# EAGLE schematic Led_Cup_Top_V3 (EAGLE 9.0.0)
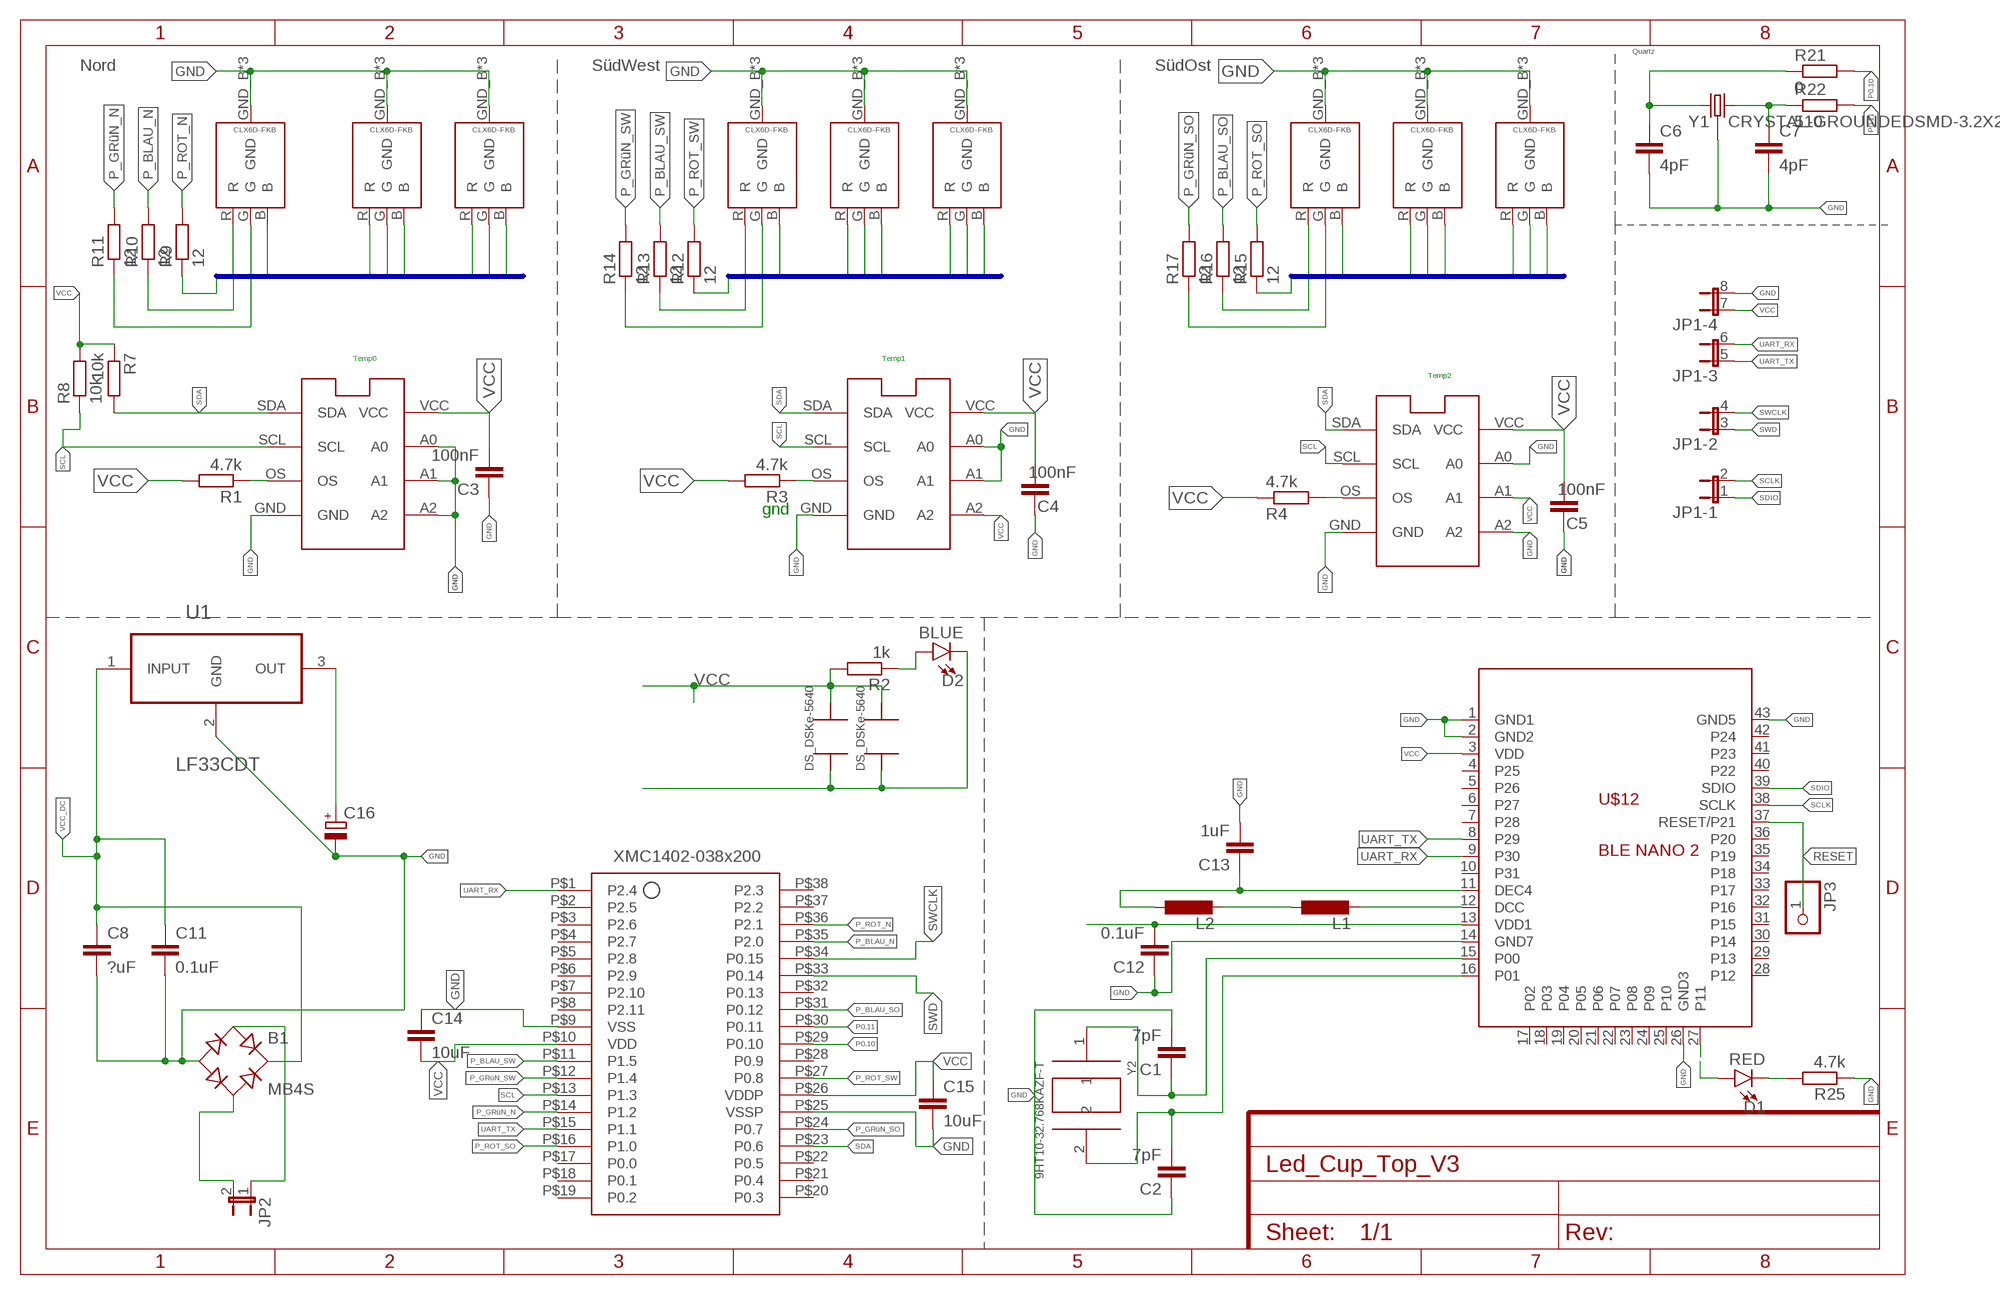
[diagram p0: schematic, sheet 1]

## Parts
B1  MB4S  [SOIC-4]
C1  7pF  C-EUC0805  [C0805]
C2  7pF  C-EUC0805  [C0805]
C3  100nF  C-EUC0805  [C0805]
C4  100nF  C-EUC0805  [C0805]
C5  100nF  C-EUC0805  [C0805]
C6  4pF  C-EUC0805  [C0805]
C7  4pF  C-EUC0805  [C0805]
C8  ?uF  C-EUC0805  [C0805]
C11  0.1uF  C-EUC0805  [C0805]
C12  0.1uF  C-EUC0805  [C0805]
C13  1uF  C-EUC0603  [C0603]
C14  10uF  C-EUC0805  [C0805]
C15  10uF  C-EUC0805  [C0805]
C16  CPOL-EUA/3216-18W  [A/3216-18W]
D1  RED  LED-RED0603  [LED-0603]
D2  BLUE  LED-BLUE0603  [LED-0603]
IC1  LM75Mini_TempS N  LM75MINI  [LM75MINI]
IC2  LM75Mini_TempSW  LM75MINI  [LM75MINI]
IC3  LM75Mini_TempSE  LM75MINI  [LM75MINI]
JP1  JP4QE  [JP4Q]
JP2  JP1E  [JP1]
JP3  PINHD-1X1  [1X01]
L1  L-EUL2012C  [L2012C]
L2  L-EUL2012C  [L2012C]
R1  4.7k  R-EU_R0805  [R0805]
R2  1k  R-EU_R0805  [R0805]
R3  4.7k  R-EU_R0805  [R0805]
R4  4.7k  R-EU_R0805  [R0805]
R7  10k  R-EU_R0805  [R0805]
R8  10k  R-EU_R0805  [R0805]
R9  12  R-EU_R0805  [R0805]
R10  12  R-EU_R0805  [R0805]
R11  12  R-EU_R0805  [R0805]
R12  12  R-EU_R0805  [R0805]
R13  12  R-EU_R0805  [R0805]
R14  12  R-EU_R0805  [R0805]
R15  12  R-EU_R0805  [R0805]
R16  12  R-EU_R0805  [R0805]
R17  12  R-EU_R0805  [R0805]
R21  0  R-EU_R0805  [R0805]
R22  510  R-EU_R0805  [R0805]
R25  4.7k  R-EU_R0805  [R0805]
U1  LF33CDT  [TO228P972X240-3N]
U$1  CREEPLCC6  [CREEPLCC6]
U$2  CREEPLCC6  [CREEPLCC6]
U$3  CREEPLCC6  [CREEPLCC6]
U$4  CREEPLCC6  [CREEPLCC6]
U$5  CREEPLCC6  [CREEPLCC6]
U$6  CREEPLCC6  [CREEPLCC6]
U$7  CREEPLCC6  [CREEPLCC6]
U$8  CREEPLCC6  [CREEPLCC6]
U$9  CREEPLCC6  [CREEPLCC6]
U$10  XMC1400_38P  [XMC1400_38P]
U$11  GOLDCAP  [GOLDCAP]
U$12  BLE NANO 2  RBT07  [RBT07]
U$13  GOLDCAP  [GOLDCAP]
Y1  CRYSTAL-GROUNDEDSMD-3.2X2.5  [CRYSTAL-SMD-3.2X2.5MM]
Y2  9HT10-32.768KAZF-T  [XTAL320X150X75]

## Nets
BLAU_N: R10.1 U$1.B U$2.B U$3.B
BLAU_SO: R16.1 U$7.B U$8.B U$9.B
BLAU_SW: R13.1 U$4.B U$5.B U$6.B
GND: B1.- C1.2 C2.1 C3.1 C4.1 C5.1 C6.2 C7.2 C8.2 C11.2 C12.1 C13.2 C14.1 C15.2 C16.- D2.C IC1.A0 IC1.A1 IC1.A2 IC1.GND IC2.A0 IC2.A1 IC2.GND IC3.A0 IC3.A2 IC3.GND JP1.8 R25.1 U1.2(GND) U$1.GND_B(GND) U$1.GND_G(GND) U$1.GND_R(GND) U$2.GND_B(GND) U$2.GND_G(GND) U$2.GND_R(GND) U$3.GND_B(GND) U$3.GND_G(GND) U$3.GND_R(GND) U$4.GND_B(GND) U$4.GND_G(GND) U$4.GND_R(GND) U$5.GND_B(GND) U$5.GND_G(GND) U$5.GND_R(GND) U$6.GND_B(GND) U$6.GND_G(GND) U$6.GND_R(GND) U$7.GND_B(GND) U$7.GND_G(GND) U$7.GND_R(GND) U$8.GND_B(GND) U$8.GND_G(GND) U$8.GND_R(GND) U$9.GND_B(GND) U$9.GND_G(GND) U$9.GND_R(GND) U$10.P$9(VSS) U$10.P$25(VSSP) U$11.P$1 U$12.1(GND1) U$12.2(GND2) U$12.14(GND7) U$12.26(GND3) U$12.43(GND5) U$13.P$1 Y1.2 Y1.4
GRüN_N: R11.1 U$1.G U$2.G U$3.G
GRüN_SO: R17.1 U$7.G U$8.G U$9.G
GRüN_SW: R14.1 U$4.G U$5.G U$6.G
N$1: IC1.OS R1.1
N$2: IC3.OS R4.2
N$3: IC2.OS R3.1
N$7: C16.+ U1.3(OUT)
N$28: B1.~2(AC2) JP2.2
N$29: C7.1 R22.1 Y1.3
N$30: C6.1 R21.1 Y1.1
N$34: D2.A R2.1
N$35: B1.~1(AC1) JP2.1
N$36: L1.2 U$12.12(DCC)
N$38: L1.1 L2.2
N$39: C13.1 L2.1 U$12.11(DEC4)
N$70: C1.1 U$12.15(P00) Y2.1
N$71: C2.2 U$12.16(P01) Y2.2
N$74: D1.C R25.2
N$75: D1.A U$12.27(P11)
P0.10: R21.2 U$10.P$29(P0.10)
P0.11: R22.2 U$10.P$30(P0.11)
P_BLAU_N: R10.2 U$10.P$35(P2.0)
P_BLAU_SO: R16.2 U$10.P$31(P0.12)
P_BLAU_SW: R13.2 U$10.P$11(P1.5)
P_GRüN_N: R11.2 U$10.P$14(P1.2)
P_GRüN_SO: R17.2 U$10.P$24(P0.7)
P_GRüN_SW: R14.2 U$10.P$12(P1.4)
P_ROT_N: R9.2 U$10.P$36(P2.1)
P_ROT_SO: R15.2 U$10.P$16(P1.0)
P_ROT_SW: R12.2 U$10.P$27(P0.8)
RESET: JP3.1 U$12.37(RESET/P21)
ROT_N: R9.1 U$1.R U$2.R U$3.R
ROT_SO: R15.1 U$7.R U$8.R U$9.R
ROT_SW: R12.1 U$4.R U$5.R U$6.R
SCL: IC1.SCL IC2.SCL IC3.SCL R8.1 U$10.P$13(P1.3)
SCLK: JP1.2 U$12.38(SCLK)
SDA: IC1.SDA IC2.SDA IC3.SDA R7.2 U$10.P$23(P0.6)
SDIO: JP1.1 U$12.39(SDIO)
SWCLK: JP1.4 U$10.P$34(P0.15)
SWD: JP1.3 U$10.P$33(P0.14)
UART_RX: JP1.6 U$10.P$1(P2.4) U$12.9(P30)
UART_TX: JP1.5 U$10.P$15(P1.1) U$12.8(P29)
VCC: C3.2 C4.2 C5.2 C12.2 C14.2 C15.1 IC1.VCC IC2.A2 IC2.VCC IC3.A1 IC3.VCC JP1.7 R1.2 R2.2 R3.2 R4.1 R7.1 R8.2 U$10.P$10(VDD) U$10.P$26(VDDP) U$11.P$2 U$12.3(VDD) U$12.13(VDD1) U$13.P$2
VCC_DC: B1.+ C8.1 C11.1 U1.1(INPUT)
Unconnected: U$10.P$2(P2.5) U$10.P$3(P2.6) U$10.P$4(P2.7) U$10.P$5(P2.8) U$10.P$6(P2.9) U$10.P$7(P2.10) U$10.P$8(P2.11) U$10.P$17(P0.0) U$10.P$18(P0.1) U$10.P$19(P0.2) U$10.P$20(P0.3) U$10.P$21(P0.4) U$10.P$22(P0.5) U$10.P$28(P0.9) U$10.P$32(P0.13) U$10.P$37(P2.2) U$10.P$38(P2.3) U$12.4(P25) U$12.5(P26) U$12.6(P27) U$12.7(P28) U$12.10(P31) U$12.17(P02) U$12.18(P03) U$12.19(P04) U$12.20(P05) U$12.21(P06) U$12.22(P07) U$12.23(P08) U$12.24(P09) U$12.25(P10) U$12.28(P12) U$12.29(P13) U$12.30(P14) U$12.31(P15) U$12.32(P16) U$12.33(P17) U$12.34(P18) U$12.35(P19) U$12.36(P20) U$12.40(P22) U$12.41(P23) U$12.42(P24)

## Buses
ROT_N,BLAU_N,GRüN_N,WHITE_N
ROT_SW,BLAU_SW,GRüN_SW,WHITE_SW
ROT_SO,BLAU_SO,GRüN_SO,WHITE_SO

## Notes on the sheet
- Quartz
- Nord | SüdWest | SüdOst
- Temp0 | Temp1
- Temp2
- gnd

## Library data of the parts
B1 = rectifier:MB*S: Bridge Rectifier Source: http://www.fairchildsemi.com/ds/MB/MB6S.pdf
C1-C8 C11-C15 = rcl:C-EU: CAPACITOR, European symbol; SPICEPREFIX: C
C16 = rcl:CPOL-EU: POLARIZED CAPACITOR, European symbol; SPICEPREFIX: C
D1 = SparkFun-LED:LED-RED: Red SMD LED Used in manufacturing of most products at SparkFun Packages: 0603 - SMD 0603 package [Product Link] <http://docs.avagotech.com/docs/AV02-0551EN> 0603 SMART - SMD 0603 SMART package ( more efficient and expensive)[Product Link] <http://www.osram-os.com/Graphics/XPic2/00077099_0.pdf> 1206 - SMD1206 package [Product Link] <https://www.sparkfun.com/datasheets/DevTools/LilyPad/Q150OVS4.pdff> SparkFun Products: Pro Mini 328 -5V <https://www.sparkfun.com/products/821> RedBoard <https://www.sparkfun.com/products/12757> IOIO-OTG <https://www.sparkfun.com/products/13613>; PROD_ID: DIO-00819
D2 = SparkFun-LED:LED-BLUE: Blue SMD LED Used in manufacturing of various products at SparkFun Packages: 0603 - SMD 0603 package [Product Link] <http://www.digikey.com/product-detail/en/SMLE12BC7TT86/511-1589-2-ND/1641808> 1206 - SMD1206 package [Product Link] <http://www.digikey.com/product-detail/en/lite-on-inc/LTST-C150TBKT/160-1643-1-ND/573584> SparkFun Products: ESP8266 Thing-Dev Board <https://www.sparkfun.com/products/13711> RedBoard <https://www.sparkfun.com/products/12757>; PROD_ID: DIO-08575
IC1-IC3 = 1_MynewBib:LM75MINI
JP1 = jumper:JP4QE: JUMPER
JP2 = jumper:JP1E: JUMPER
JP3 = pinhead:PINHD-1X1: PIN HEADER
L1 L2 = rcl:L-EU: INDUCTOR, European symbol; SPICEPREFIX: L
R1-R4 R7-R17 R21 R22 R25 = rcl:R-EU_: RESISTOR, European symbol; SPICEPREFIX: R
U1 = LF33CDT:LF33CDT: LDO, 0.45VDO, 1A, 3.3V, 1%, 3TO252; AVAILABILITY: Unavailable; DESCRIPTION: Voltage stabiliser; LDO, fixed; 3.3V; 1A; TO252AA; SMD; MF: STMicroelectronics; MP: LF33CDT; PACKAGE: TO-252 STMicroelectronics; PRICE: 0.66 USD
U$1-U$9 = 1_MynewBib:CREEPLCC6
U$10 = 1_MynewBib:XMC1400_38P
U$11 U$13 = 1_MynewBib:GOLDCAP
U$12 = 1RedBeard:RBT07
Y1 = SparkFun-Clocks:CRYSTAL-GROUNDED: Crystals w/ Ground Pin (Generic) These are passive quartz crystals, which can be used as a clock source for a microcontroller. Crystal's are usually two-terminal devices. A third terminal may be optionally connected to ground, as recommended by the manufaturer.
Y2 = 9HT10-32.768KAZF-T:9HT10-32.768KAZF-T: Crystal, 32.768khz, 12.5pf, 3.2 x 1.5mm

## Net classes
0 default: clearance 0.205 mm